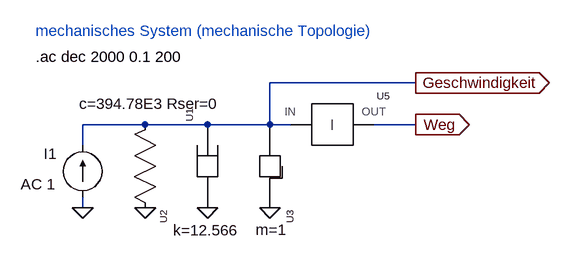
[diagram p0: schematic Isomorph_1.asc]
Isomorph_1.asc, the LTspice schematic file:
Version 4
SHEET 1 880 680
WIRE 448 -400 224 -400
WIRE 32 -336 -64 -336
WIRE 128 -336 32 -336
WIRE 224 -336 224 -400
WIRE 224 -336 128 -336
WIRE 256 -336 224 -336
WIRE 448 -336 384 -336
WIRE -64 -304 -64 -336
WIRE -64 -208 -64 -224
FLAG 32 -208 0
FLAG 128 -208 0
FLAG 224 -208 0
FLAG -64 -208 0
FLAG 448 -336 Weg
IOPIN 448 -336 Out
FLAG 448 -400 Geschwindigkeit
IOPIN 448 -400 Out
SYMBOL Mechatronik\\Mechanik_Impuls\\R_m_p 128 -256 R270
WINDOW 39 -83 -53 VRight 2
SYMATTR SpiceLine k=12.566
SYMATTR InstName U1
SYMBOL Mechatronik\\Mechanik_Impuls\\L_m_p 32 -288 R90
WINDOW 39 -80 -114 VRight 2
SYMATTR SpiceLine c=394.78E3 Rser=0
SYMATTR InstName U2
SYMBOL Mechatronik\\Mechanik_Impuls\\C_m_p 224 -288 R90
WINDOW 39 114 -26 VRight 2
SYMATTR SpiceLine m=1
SYMATTR InstName U3
SYMBOL current -64 -224 R180
WINDOW 0 40 67 Left 2
WINDOW 3 24 0 Invisible 2
WINDOW 123 42 20 Left 2
WINDOW 39 0 0 Left 0
SYMATTR InstName I1
SYMATTR Value 1
SYMATTR Value2 AC 1
SYMBOL Mechatronik\\Control\\I-Glied 320 -336 R0
SYMATTR SpiceLine ic=0
SYMATTR InstName U5
TEXT -136 -440 Left 2 !.ac dec 2000 0.1 200
TEXT -136 -480 Left 2 ;mechanisches System (mechanische Topologie)

The netlist it stands for:
* Isomorph_1.asc
XU1 0 Geschwindigkeit R_m_p k=12.566  ; pins 1 2
XU2 Geschwindigkeit 0 L_m_p c=394.78E3 Rser=0  ; pins 1 2
XU3 Geschwindigkeit 0 C_m_p m=1 v=  ; pins 1 2
I1 0 Geschwindigkeit 1 AC 1
XU5 Geschwindigkeit Weg I-Glied ic=0  ; pins IN OUT
.ac dec 2000 0.1 200
* mechanisches System (mechanische Topologie)
.lib Mechatronik.lib
.lib Control.lib
.backanno
.end